# Altium schematic sheet ExtensionConnector.SchDoc
size A4; Revision: B.2(PCB.SCH)
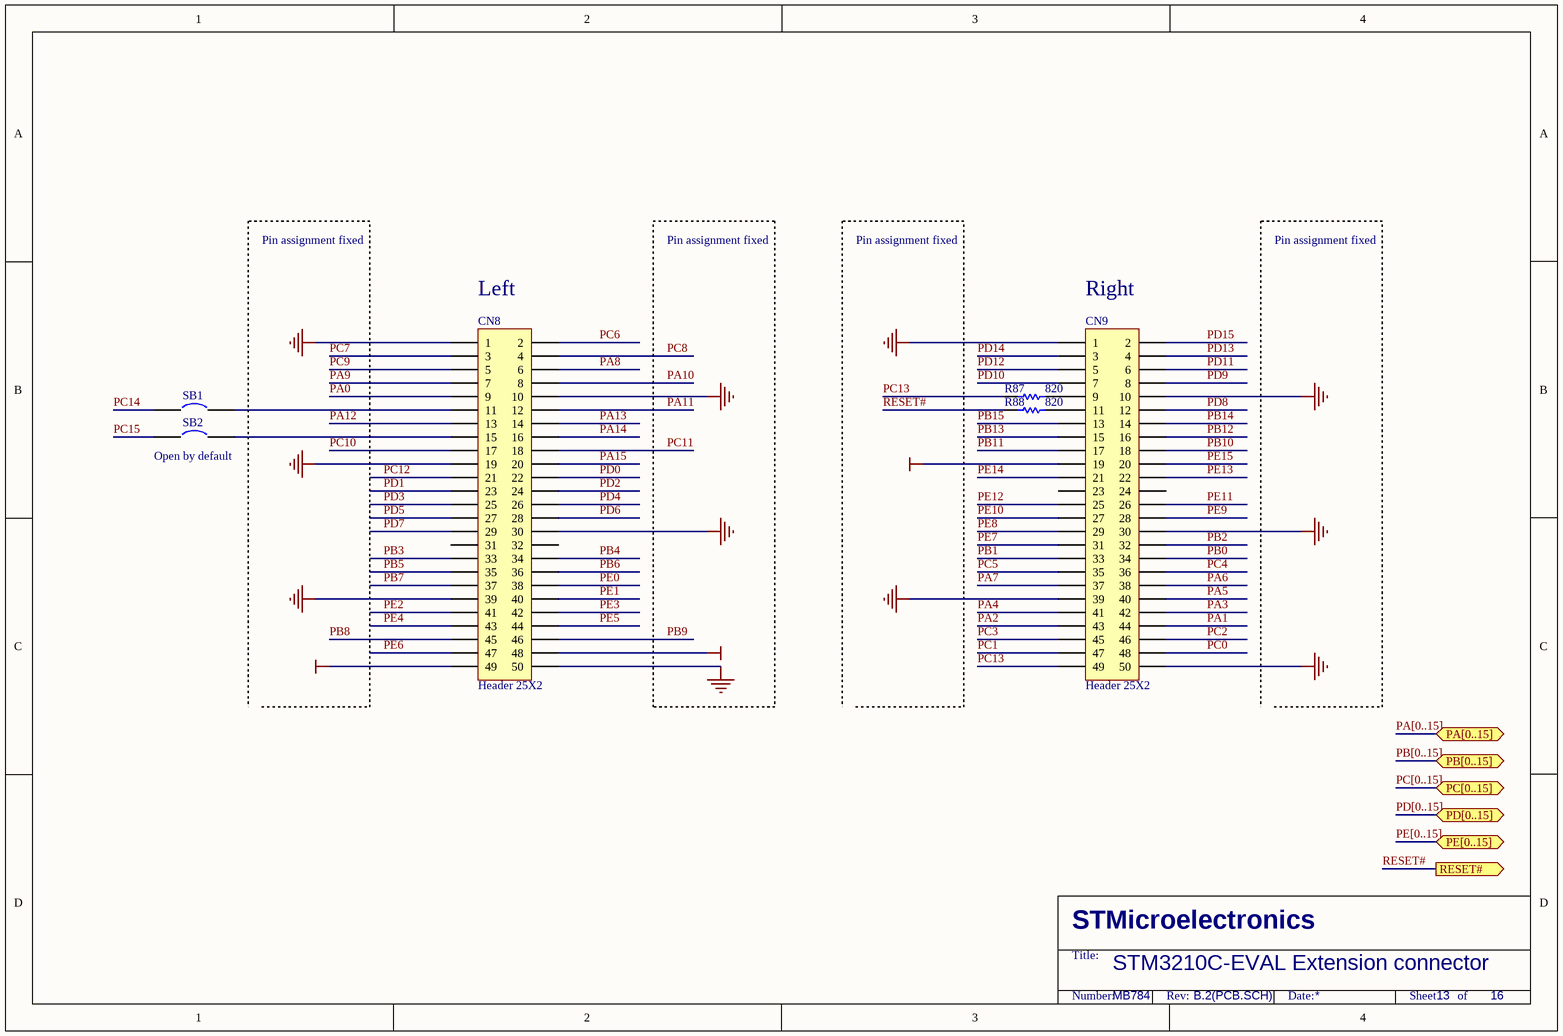
[diagram p0: ExtensionConnector.SchDoc]

## Parts
CN8  Header 25X2  [2*25P]
CN9  Header 25X2  [2*25P]
R87  820  [0603R]
R88  820  [0603R]
SB1  (no value)  [JP2_SMD]
SB2  (no value)  [JP2_SMD]

## Ports
PA[0..15] (bidir), PB[0..15] (bidir), PC[0..15] (bidir), PD[0..15] (bidir), PE[0..15] (bidir), RESET# (out)

## Nets
+3V3: CN8.48
D5V: CN8.49 CN9.19
GND: CN8.1 CN8.10 CN8.19 CN8.30 CN8.39 CN8.50 CN9.1 CN9.10 CN9.30 CN9.39 CN9.50
PA0: CN8.9
PA1: CN9.44
PA2: CN9.43
PA3: CN9.42
PA4: CN9.41
PA5: CN9.40
PA6: CN9.38
PA7: CN9.37
PA8: CN8.6
PA9: CN8.7
PA10: CN8.8
PA11: CN8.12
PA12: CN8.13
PA13: CN8.14
PA14: CN8.16
PA15: CN8.20
PB0: CN9.34
PB1: CN9.33
PB2: CN9.32
PB3: CN8.33
PB4: CN8.34
PB5: CN8.35
PB6: CN8.36
PB7: CN8.37
PB8: CN8.45
PB9: CN8.46
PB10: CN9.18
PB11: CN9.17
PB12: CN9.16
PB13: CN9.15
PB14: CN9.14
PB15: CN9.13
PC0: CN9.48
PC1: CN9.47
PC2: CN9.46
PC3: CN9.45
PC4: CN9.36
PC5: CN9.35
PC6: CN8.2
PC7: CN8.3
PC8: CN8.4
PC9: CN8.5
PC10: CN8.17
PC11: CN8.18
PC12: CN8.21
PC13: CN9.49 R87.1
PC14: SB1.1
PC15: SB2.1
PD0: CN8.22
PD1: CN8.23
PD2: CN8.24
PD3: CN8.25
PD4: CN8.26
PD5: CN8.27
PD6: CN8.28
PD7: CN8.29
PD8: CN9.12
PD9: CN9.8
PD10: CN9.7
PD11: CN9.6
PD12: CN9.5
PD13: CN9.4
PD14: CN9.3
PD15: CN9.2
PE0: CN8.38
PE1: CN8.40
PE2: CN8.41
PE3: CN8.42
PE4: CN8.43
PE5: CN8.44
PE6: CN8.47
PE7: CN9.31
PE8: CN9.29
PE9: CN9.28
PE10: CN9.27
PE11: CN9.26
PE12: CN9.25
PE13: CN9.22
PE14: CN9.21
PE15: CN9.20
RESET#: R88.2 ; port RESET#
NetCN8_11: CN8.11 SB1.2
NetCN8_15: CN8.15 SB2.2
NetCN9_9: CN9.9 R87.2
NetCN9_11: CN9.11 R88.1

Not connected (* = marked no-connect by the designer): CN8 31 32; CN9 23 24

## Buses and harness runs
bus PA[0..15] = port PA[0..15]
bus PB[0..15] = port PB[0..15]
bus PC[0..15] = port PC[0..15]
bus PD[0..15] = port PD[0..15]
bus PE[0..15] = port PE[0..15]

## Notes on the sheet
- Pin assignment fixed
- (near CN8) Left
- (near CN9) Right
- (near SB2) Open by default
- STM3210C-EVAL Extension connector
- MB784
- 13
- 16
- STMicroelectronics
- Title:
- Number:
- Rev:
- Date:
- Sheet       of

## Library data of the parts
CN8 CN9 = Header 25X2: Header, 25-Pin, Dual row; Revision: 17-Jul-2002: Re-released for DXP Platform.; Publisher: Altium Limited
R87 R88 = Res1: Resistor; Value: 1K; Published: 8-Jun-2000; Revision: July-2002: Re-released for DXP Platform.; Publisher: Altium Limited
SB1 SB2 = Circuit Breaker: Published: 24-Mar-1999; Revision: July-2002: Re-released for DXP Platform.; Publisher: Altium Limited